# Altium schematic sheet 32.SchDoc
size 513 x 386 mm
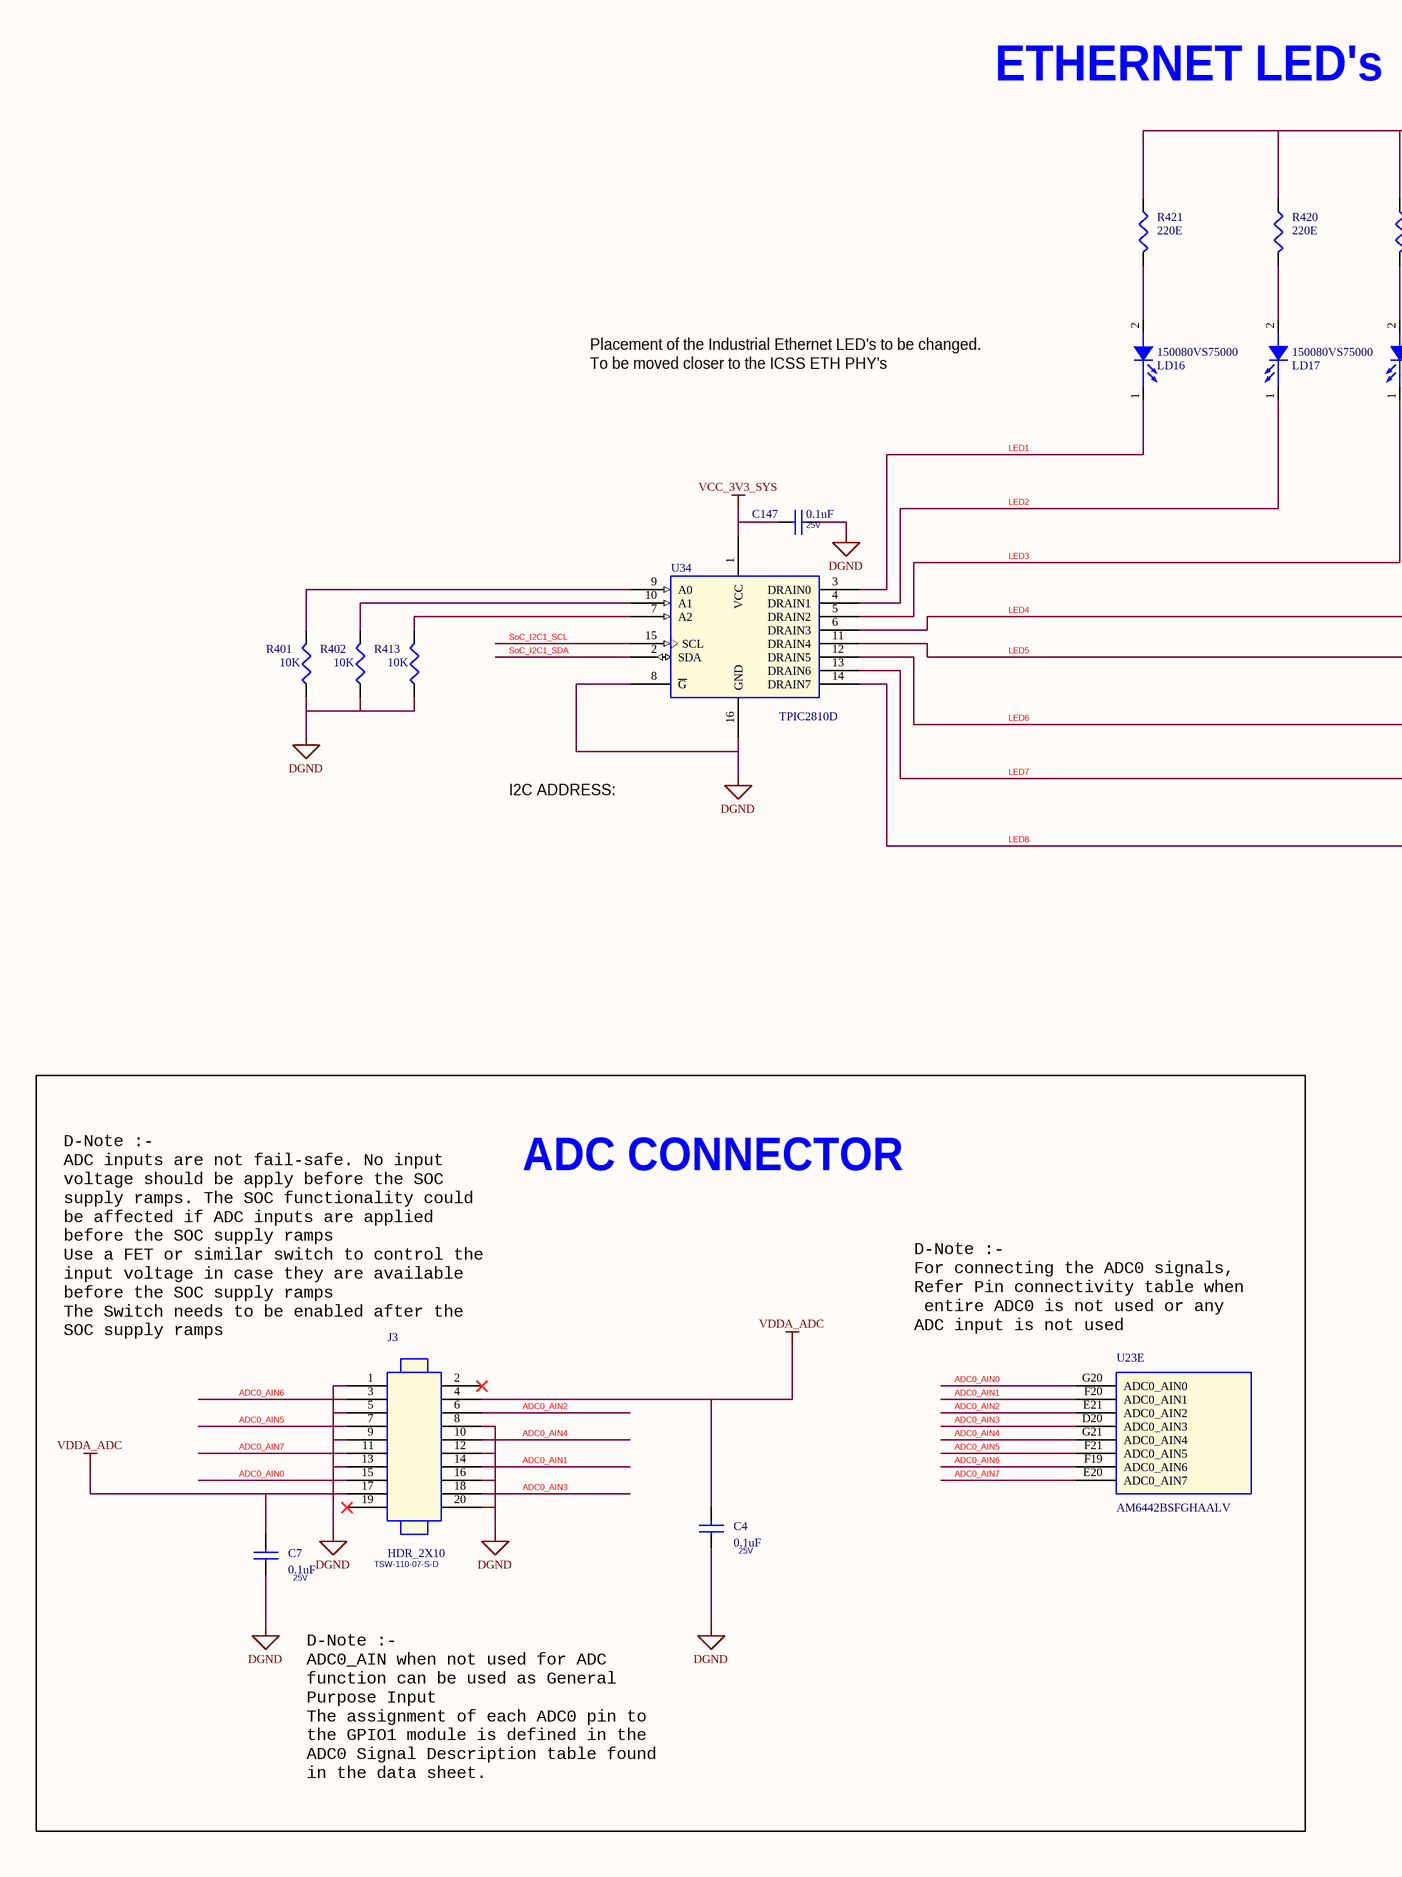
[diagram p0: 32.SchDoc, left]
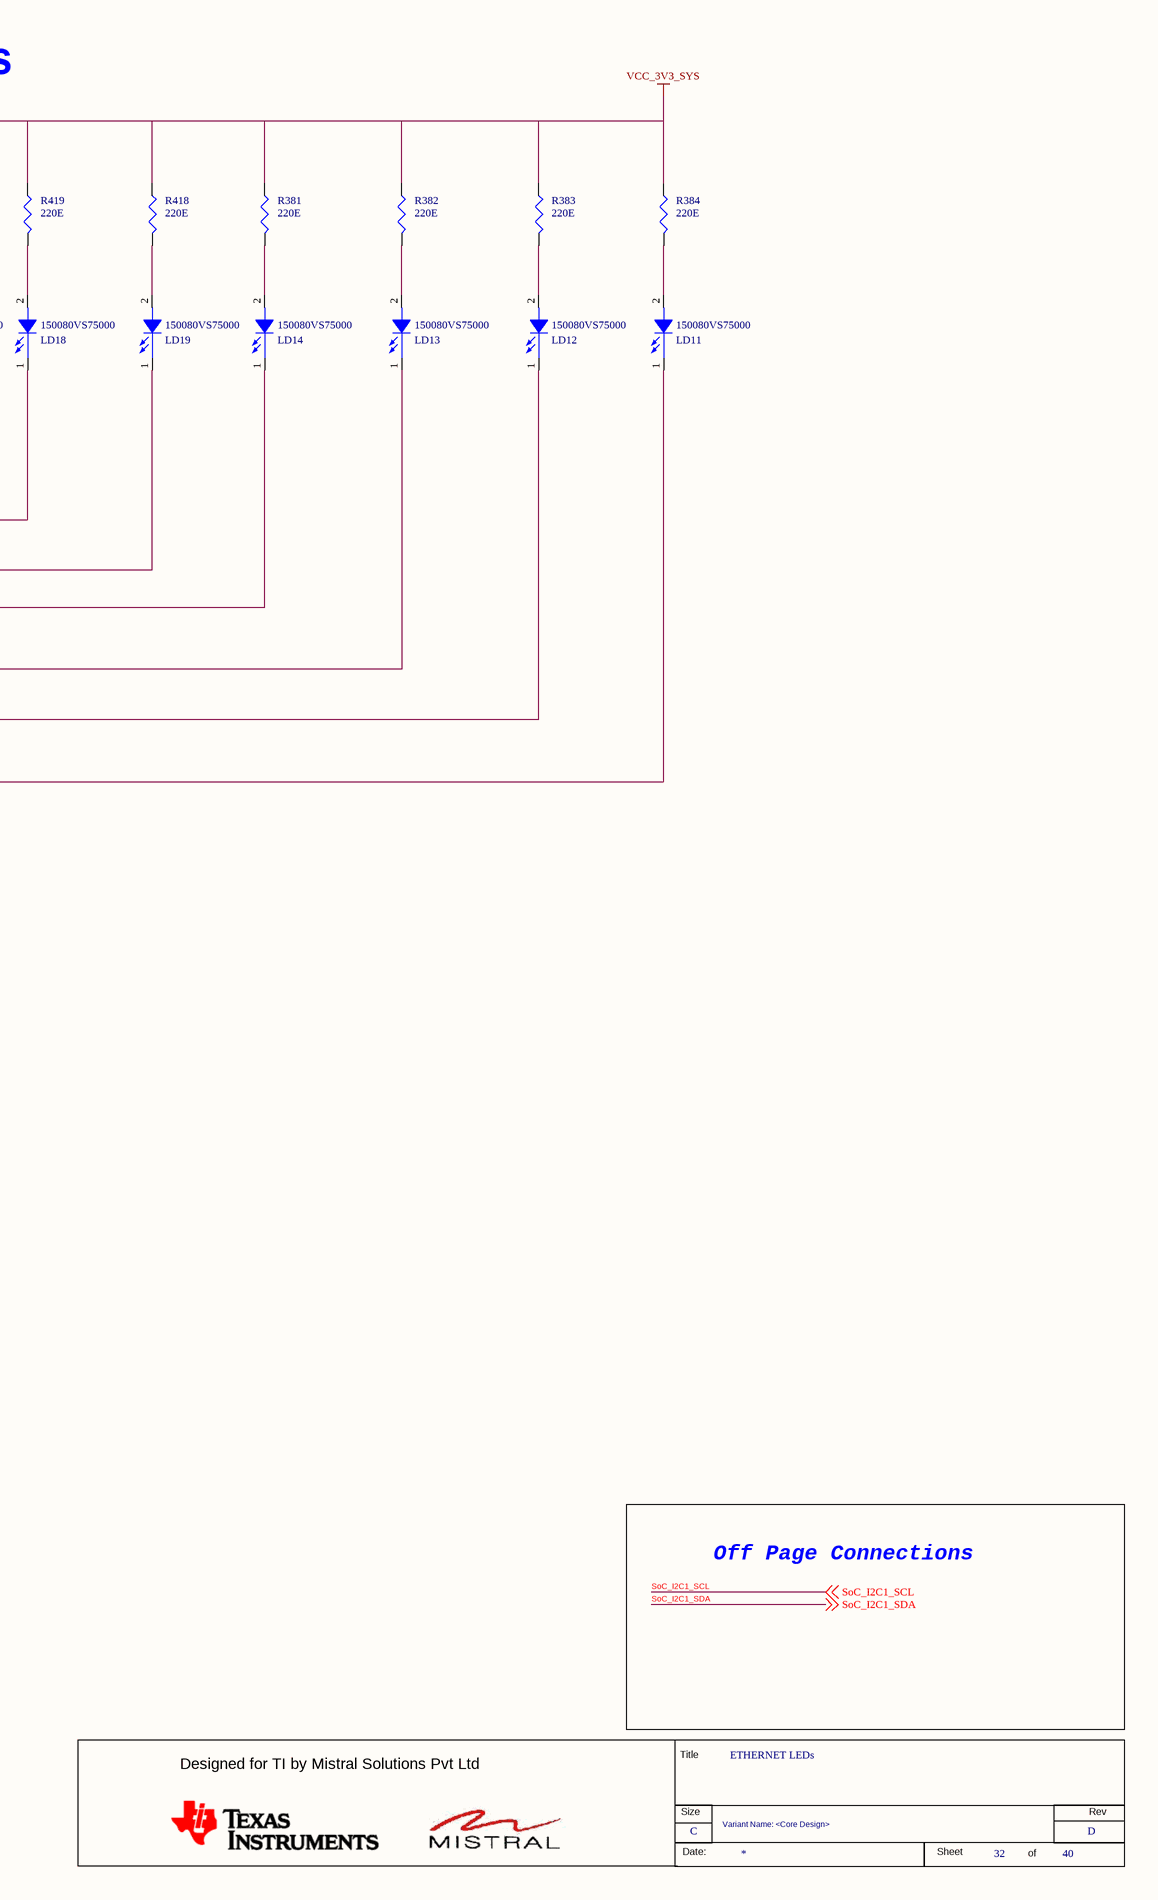
[diagram p1: 32.SchDoc, right]

## Parts
*  RevCode: D  Title: ETHERNET LEDs  Page Size: C  Page Number: 32  Page Count: 40  Variant Name: <Core Design>  (hidden comment: MISTRAL_TITLEBLK_CSIZE)  (graphical)
C4  0.1uF  Voltage: 25V  [CAP0402_0-75]
C7  0.1uF  Voltage: 25V  [CAP0402_0-75]
C147  0.1uF  Voltage: 25V  [CAP0402_0-75]
J3  HDR_2X10  Mfr_part_number: TSW-110-07-S-D  [HDR_2X10_TSW_100_S_T]
LD11  150080VS75000  [LED_150080VS75000_80X50_SMD_0-8]
LD12  150080VS75000  [LED_150080VS75000_80X50_SMD_0-8]
LD13  150080VS75000  [LED_150080VS75000_80X50_SMD_0-8]
LD14  150080VS75000  [LED_150080VS75000_80X50_SMD_0-8]
LD16  150080VS75000  [LED_150080VS75000_80X50_SMD_0-8]
LD17  150080VS75000  [LED_150080VS75000_80X50_SMD_0-8]
LD18  150080VS75000  [LED_150080VS75000_80X50_SMD_0-8]
LD19  150080VS75000  [LED_150080VS75000_80X50_SMD_0-8]
R381  220E  [RES0402_0-5]
R382  220E  [RES0402_0-5]
R383  220E  [RES0402_0-5]
R384  220E  [RES0402_0-5]
R401  10K  [RES0402_0-5]
R402  10K  [RES0402_0-5]
R413  10K  [RES0402_0-5]
R418  220E  [RES0402_0-5]
R419  220E  [RES0402_0-5]
R420  220E  [RES0402_0-5]
R421  220E  [RES0402_0-5]
U23  AM6442BSFGHAALV  [FCBGA441_31-49_680X680_2-6]  (part E of 16)
U34  TPIC2810D  [SOIC16_1-8]

## Blocks framed on the sheet
ADC CONNECTOR: C4 C7 J3 U23

## Nets
DGND: C4.1 C7.1 C147.2 J3.1 J3.5 J3.8 J3.9 J3.12 J3.13 J3.16 J3.20 R401.1 R402.1 R413.1 U34.8(~{G}) U34.16(GND)
VCC_3V3_SYS: C147.1 R381.1 R382.1 R383.1 R384.1 R418.1 R419.1 R420.1 R421.1 U34.1(VCC)
VDDA_ADC: C4.2 C7.2 J3.4 J3.17
ADC0_AIN0: J3.15 U23.G20(ADC0_AIN0)
ADC0_AIN1: J3.14 U23.F20(ADC0_AIN1)
ADC0_AIN2: J3.6 U23.E21(ADC0_AIN2)
ADC0_AIN3: J3.18 U23.D20(ADC0_AIN3)
ADC0_AIN4: J3.10 U23.G21(ADC0_AIN4)
ADC0_AIN5: J3.7 U23.F21(ADC0_AIN5)
ADC0_AIN6: J3.3 U23.F19(ADC0_AIN6)
ADC0_AIN7: J3.11 U23.E20(ADC0_AIN7)
LED1: LD16.1(CATHODE) U34.3(DRAIN0)
LED2: LD17.1(CATHODE) U34.4(DRAIN1)
LED3: LD18.1(CATHODE) U34.5(DRAIN2)
LED4: LD19.1(CATHODE) U34.6(DRAIN3)
LED5: LD14.1(CATHODE) U34.11(DRAIN4)
LED6: LD13.1(CATHODE) U34.12(DRAIN5)
LED7: LD12.1(CATHODE) U34.13(DRAIN6)
LED8: LD11.1(CATHODE) U34.14(DRAIN7)
SoC_I2C1_SCL: U34.15(SCL) ; off-sheet SoC_I2C1_SCL
SoC_I2C1_SDA: U34.2(SDA) ; off-sheet SoC_I2C1_SDA
NetLD11_2: LD11.2(ANODE) R384.2
NetLD12_2: LD12.2(ANODE) R383.2
NetLD13_2: LD13.2(ANODE) R382.2
NetLD14_2: LD14.2(ANODE) R381.2
NetLD16_2: LD16.2(ANODE) R421.2
NetLD17_2: LD17.2(ANODE) R420.2
NetLD18_2: LD18.2(ANODE) R419.2
NetLD19_2: LD19.2(ANODE) R418.2
NetR401_2: R401.2 U34.9(A0)
NetR402_2: R402.2 U34.10(A1)
NetR413_2: R413.2 U34.7(A2)

Not connected (* = marked no-connect by the designer): J3 2* 19*

## Notes on the sheet
- ETHERNET LED's
- Placement of the Industrial Ethernet LED's to be changed.
  To be moved closer to the ICSS ETH PHY's
- I2C ADDRESS: 0x60
- (near J3) D-Note :-
  ADC inputs are not fail-safe. No input
  voltage should be apply before the SOC
  supply ramps. The SOC functionality could
  be affected if ADC inputs are applied
  before the SOC supply ramps
  Use a FET or similar switch to control the
  input voltage in case they are available
  before the SOC supply ramps
  The Switch needs to be enabled after the
  SOC supply ramps
- D-Note :-
  For connecting the ADC0 signals,
  Refer Pin connectivity table when
  entire ADC0 is not used or any
  ADC input is not used
- D-Note :-
  ADC0_AIN when not used for ADC
  function can be used as General
  Purpose Input
  The assignment of each ADC0 pin to
  the GPIO1 module is defined in the
  ADC0 Signal Description table found
  in the data sheet.
- Off Page Connections
- (in symbol MISTRAL_TITLEBLK_CSIZE) Title; Designed for TI by Mistral Solutions Pvt Ltd; Size; Rev; Date:; Sheet; of

## Library data of the parts
* = MISTRAL_TITLEBLK_CSIZE: Issue: 1.0; Page Create Date: March  8, 1995; Page Modify Date: *
C4 C7 = CAP_Dup3: CAP CERAMIC 0.1uF 25V 20% X5R 0402; Alt_Mfr_name: YAGEO AMERICA; Part_type: CAPACITORS\CERAMIC; Mfr_part_number: 885012105018; Mfr_name: WURTH ELECTRONICS; Mistral Part No: 120020080003-R; Alt_Mfr_part_number: CC0402KRX5R8BB104; Custom_Duty: 15%; Customs_HS_Code: 85322990; Wattage: NA; Project: AM64x_EVM_BRD; Footprint Path: Y:\MIS_DATABASE\Library\ALTIUM_TOOL\PCB_FOOTPRINTS\Altium_Footprint_Lib.PcbLib; Library Path: Y:\MIS_DATABASE\Library\ALTIUM_TOOL\SCHEMATICS_PARTS\MS_DISCRETE_Library.schlib; Footprint Ref: CAP0402_0-75; Library Ref: CAP; MECHANICAL 3D STEP FILE: CAP0402_0-75; Chkd/date: MANIRAJA/170820; Crtd /date: ALVY/170820; Datasheet: Y:\MIS_DATABASE\DATASHEETS\CAPACITORS\885012105018.PDF; Temperature: -55癈+85癈; Weight: 0.65mg; Height: 0.55MM; Distributor_part_number: 732-7495-1-ND; Distributor_name: DIGIKEY; Package: 0402; Tolerance: 20%; PCB Footprint: CAP0402_0-75
C147 = CAP_Dup3: CAP CERAMIC 0.1uF 25V 20% X5R 0402; Alt_Mfr_part_number: CC0402KRX5R8BB104; Mistral Part No: 120020080003-R; Mfr_name: WURTH ELECTRONICS; Mfr_part_number: 885012105018; Part_type: CAPACITORS\CERAMIC; Alt_Mfr_name: YAGEO AMERICA; Project: AM64x_EVM_BRD; Wattage: NA; Customs_HS_Code: 85322990; Custom_Duty: 15%; Tolerance: 20%; Package: 0402; Distributor_name: DIGIKEY; Distributor_part_number: 732-7495-1-ND; Height: 0.55MM; Weight: 0.65mg; Temperature: -55癈+85癈; Datasheet: Y:\MIS_DATABASE\DATASHEETS\CAPACITORS\885012105018.PDF; Crtd /date: ALVY/170820; Chkd/date: MANIRAJA/170820; MECHANICAL 3D STEP FILE: CAP0402_0-75; Library Ref: CAP; Footprint Ref: CAP0402_0-75; Library Path: Y:\MIS_DATABASE\Library\ALTIUM_TOOL\SCHEMATICS_PARTS\MS_DISCRETE_Library.schlib; Footprint Path: Y:\MIS_DATABASE\Library\ALTIUM_TOOL\PCB_FOOTPRINTS\Altium_Footprint_Lib.PcbLib; PCB Footprint: CAP0402_0-75
J3 = HEADER_10X2: CON HDR 2X10 2.54MM PITCH ST TH; Part_type: CONNECTOR\HEADERS; Mfr_name: SAMTEC; Mistral Part No: 150009090001-R; Custom_Duty: 0.24; Customs_HS_Code: 85369090; Wattage: NA; Project: SMART VIEW_NVR; PCB Footprint: HDR_2X10_TSW_100_S_T; Library Ref: HEADER_10X2; Chkd/date: NAVEED/140515; Crtd /date: MAZHAR/020909; Datasheet: Y:\MIS_DATABASE\DATASHEETS\CONNECTORS\TSW-106-23-T-S.PDF; Temperature: NA; Weight: NA; Height: 5.02MM; Distributor_part_number: SAM1032-10-ND; Distributor_name: DIGIKEY; Package: THRU-HOLE; Voltage: NA; Tolerance: NA
LD11-LD13 LD16 LD18 LD19 = DIODE_LED: DIODE LED BRIGHT GREEN SMD; Part_type: OPTO\LED; Mfr_name: WURTH ELECTRONICS; Mistral Part No: 130020080012-R; Custom_Duty: 24%; Customs_HS_Code: 85439000; Wattage: NA; Project: AM64x_EVM_BRD; Footprint Path: Y:\MIS_DATABASE\Library\ALTIUM_TOOL\PCB_FOOTPRINTS\Altium_Footprint_Lib.PcbLib; Library Path: Y:\MIS_DATABASE\Library\ALTIUM_TOOL\SCHEMATICS_PARTS\MS_OPTO_Library.schlib; MECHANICAL 3D STEP FILE: LED_150080VS75000_80X50_SMD_0-8; Chkd/date: MANIRAJA/180820; Crtd /date: ALVY/180820; Datasheet: Y:\MIS_DATABASE\DATASHEETS\DISCRETES\LEDS\150080VS75000.PDF; Temperature: -40癈+85癈; Weight: 10mg; Height: 0.80MM; Library Ref: DIODE_LED; Distributor_part_number: 732-4986-1-ND; Distributor_name: DIGIKEY; Package: SMD; Voltage: NA; Tolerance: NA; Mfr_part_number: 150080VS75000; Footprint Ref: LED_150080VS75000_80X50_SMD_0-8; PCB Footprint: LED_150080VS75000_80X50_SMD_0-8
LD14 LD17 = DIODE_LED: DIODE LED BRIGHT GREEN SMD; Mistral Part No: 130020080012-R; Mfr_name: WURTH ELECTRONICS; Part_type: OPTO\LED; Project: AM64x_EVM_BRD; Tolerance: NA; Customs_HS_Code: 85439000; Custom_Duty: 24%; Footprint Ref: LED_150080VS75000_80X50_SMD_0-8; Mfr_part_number: 150080VS75000; Voltage: NA; Wattage: NA; Package: SMD; Distributor_name: DIGIKEY; Distributor_part_number: 732-4986-1-ND; Library Ref: DIODE_LED; Height: 0.80MM; Weight: 10mg; Temperature: -40癈+85癈; Datasheet: Y:\MIS_DATABASE\DATASHEETS\DISCRETES\LEDS\150080VS75000.PDF; Crtd /date: ALVY/180820; Chkd/date: MANIRAJA/180820; MECHANICAL 3D STEP FILE: LED_150080VS75000_80X50_SMD_0-8; Library Path: Y:\MIS_DATABASE\Library\ALTIUM_TOOL\SCHEMATICS_PARTS\MS_OPTO_Library.schlib; Footprint Path: Y:\MIS_DATABASE\Library\ALTIUM_TOOL\PCB_FOOTPRINTS\Altium_Footprint_Lib.PcbLib; PCB Footprint: LED_150080VS75000_80X50_SMD_0-8
R381 R420 R421 = RESISTOR_Dup6: RES 220E 1/10W 5% 0402; Part_type: RESISTORS\FIXED; Mfr_part_number: ERJ-2GEJ221X; Mfr_name: PANASONIC-ECG; Mistral Part No: 110009030506-R; Custom_Duty: 15%; Customs_HS_Code: 85332119; Project: RED EYE; Voltage: NA; Footprint Ref: RES0402_0-5; Chkd/date: VASANTHA/291216; Crtd /date: GEETHA/260406; Datasheet: Y:\MIS_DATABASE\DATASHEETS\RESISTORS\PAN-ERJSER_NOV17.PDF; Height: 0.40MM; Distributor_part_number: P220JCT-ND; Distributor_name: DIGIKEY; Package: 0402; Wattage: 1/10W; Tolerance: 5%; Library Ref: RESISTOR; Weight: 0.8mg; Temperature: -55癈+155癈; MECHANICAL 3D STEP FILE: RES0402_0-5; Library Path: Y:\MIS_DATABASE\Library\ALTIUM_TOOL\SCHEMATICS_PARTS\MS_DISCRETE_Library.schlib; Footprint Path: Y:\MIS_DATABASE\Library\ALTIUM_TOOL\PCB_FOOTPRINTS\Altium_Footprint_Lib.PcbLib; PCB Footprint: RES0402_0-5
R382-R384 = RESISTOR_Dup6: RES 220E 1/10W 5% 0402; Part_type: RESISTORS\FIXED; Mfr_part_number: ERJ-2GEJ221X; Mfr_name: PANASONIC-ECG; Mistral Part No: 110009030506-R; Voltage: NA; Custom_Duty: 15%; Customs_HS_Code: 85332119; Project: RED EYE; Footprint Path: Y:\MIS_DATABASE\Library\ALTIUM_TOOL\PCB_FOOTPRINTS\Altium_Footprint_Lib.PcbLib; Library Path: Y:\MIS_DATABASE\Library\ALTIUM_TOOL\SCHEMATICS_PARTS\MS_DISCRETE_Library.schlib; MECHANICAL 3D STEP FILE: RES0402_0-5; Temperature: -55癈+155癈; Weight: 0.8mg; Library Ref: RESISTOR; Chkd/date: VASANTHA/291216; Crtd /date: GEETHA/260406; Datasheet: Y:\MIS_DATABASE\DATASHEETS\RESISTORS\PAN-ERJSER_NOV17.PDF; Height: 0.40MM; Distributor_part_number: P220JCT-ND; Distributor_name: DIGIKEY; Package: 0402; Wattage: 1/10W; Tolerance: 5%; Footprint Ref: RES0402_0-5; PCB Footprint: RES0402_0-5
R401 = RESISTOR_Dup6: RES 10K 1/16W 5% 0402; Mistral Part No: 110011060021-R; Mfr_name: YAGEO AMERICA; Mfr_part_number: RC0402JR-0710KL; Part_type: RESISTORS\FIXED; Project: HSE; Voltage: NA; Customs_HS_Code: 85332119; Custom_Duty: 15%; Tolerance: 5%; Wattage: 1/16W; Package: 0402; Distributor_name: DIGIKEY; Distributor_part_number: 311-10KJRCT-ND; Height: 0.40MM; Weight: 0.65mg; Temperature: -55癈+155癈; Datasheet: Y:\MIS_DATABASE\DATASHEETS\RESISTORS\RCXXXXL-SER_MAR18.PDF; Crtd /date: MAZHAR/230805; Chkd/date: VASANTHA/061216; MECHANICAL 3D STEP FILE: RES0402_0-5; Library Ref: RESISTOR; Footprint Ref: RES0402_0-5; Library Path: Y:\MIS_DATABASE\Library\ALTIUM_TOOL\SCHEMATICS_PARTS\MS_DISCRETE_Library.schlib; Footprint Path: Y:\MIS_DATABASE\Library\ALTIUM_TOOL\PCB_FOOTPRINTS\Altium_Footprint_Lib.PcbLib; PCB Footprint: RES0402_0-5
R402 R413 = RESISTOR_Dup6: RES 10K 1/16W 5% 0402; Part_type: RESISTORS\FIXED; Mfr_part_number: RC0402JR-0710KL; Mfr_name: YAGEO AMERICA; Mistral Part No: 110011060021-R; Custom_Duty: 15%; Customs_HS_Code: 85332119; Voltage: NA; Project: HSE; MECHANICAL 3D STEP FILE: RES0402_0-5; Chkd/date: VASANTHA/061216; Crtd /date: MAZHAR/230805; Datasheet: Y:\MIS_DATABASE\DATASHEETS\RESISTORS\RCXXXXL-SER_MAR18.PDF; Temperature: -55癈+155癈; Weight: 0.65mg; Height: 0.40MM; Distributor_part_number: 311-10KJRCT-ND; Distributor_name: DIGIKEY; Package: 0402; Wattage: 1/16W; Tolerance: 5%; Library Ref: RESISTOR; Footprint Ref: RES0402_0-5; Library Path: Y:\MIS_DATABASE\Library\ALTIUM_TOOL\SCHEMATICS_PARTS\MS_DISCRETE_Library.schlib; Footprint Path: Y:\MIS_DATABASE\Library\ALTIUM_TOOL\PCB_FOOTPRINTS\Altium_Footprint_Lib.PcbLib; PCB Footprint: RES0402_0-5
R418 R419 = RESISTOR_Dup6: RES 220E 1/10W 5% 0402; Mistral Part No: 110009030506-R; Mfr_name: PANASONIC-ECG; Mfr_part_number: ERJ-2GEJ221X; Part_type: RESISTORS\FIXED; Project: RED EYE; Customs_HS_Code: 85332119; Custom_Duty: 15%; Voltage: NA; Footprint Ref: RES0402_0-5; Tolerance: 5%; Wattage: 1/10W; Package: 0402; Distributor_name: DIGIKEY; Distributor_part_number: P220JCT-ND; Height: 0.40MM; Datasheet: Y:\MIS_DATABASE\DATASHEETS\RESISTORS\PAN-ERJSER_NOV17.PDF; Crtd /date: GEETHA/260406; Chkd/date: VASANTHA/291216; Library Ref: RESISTOR; Weight: 0.8mg; Temperature: -55癈+155癈; MECHANICAL 3D STEP FILE: RES0402_0-5; Library Path: Y:\MIS_DATABASE\Library\ALTIUM_TOOL\SCHEMATICS_PARTS\MS_DISCRETE_Library.schlib; Footprint Path: Y:\MIS_DATABASE\Library\ALTIUM_TOOL\PCB_FOOTPRINTS\Altium_Footprint_Lib.PcbLib; PCB Footprint: RES0402_0-5
U23 = XAM6442BSFGGAALV_BGA441: IC AM64x SoC MICROPROCESSOR BGA441; Mistral Part No: 141220080002; Mfr_name: TEXAS INSTRUMENTS; Part_type: ICS\DIGITAL\MICROPROCESSOR; Project: AM64x-GP_EVM BRD; Tolerance: NA; Customs_HS_Code: 85423100; Custom_Duty: 15%; PCB Footprint: FCBGA441_31-49_680X680_2-6; Footprint Ref: FCBGA441_31-49_680X680_2-6; Mfr_part_number: AM6442BSFGHAALV; Voltage: NA; Wattage: NA; Package: BGA441; Distributor_name: NA; Distributor_part_number: NA; Library Ref: XAM6442BSFGGAALV_BGA441; Height: 2.57MM; Weight: NA; Temperature: NA; Datasheet: Y:\MIS_DATABASE\DATASHEETS\ICS\DIGITAL\MICROCONTROLLER\AM64-SoC_SVB.PDF; Crtd /date: ALVY/300322; Chkd/date: ALVY/300322; RoHS: NA; MECHANICAL 3D STEP FILE: FCBGA441_31-49_680X680_2-6; Library Path: Y:\MIS_DATABASE\Library\ALTIUM_TOOL\SCHEMATICS_PARTS\MS_MICROPROCESSOR_Library.schlib; Footprint Path: Y:\MIS_DATABASE\Library\ALTIUM_TOOL\PCB_FOOTPRINTS\Altium_Footprint_Lib.PcbLib
U34 = TPIC2810D_SOIC16: IC 8-BIT LED DRIVER WITH I2C INTERFACE SOIC16; Mistral Part No: 141017080026-R; Mfr_name: TEXAS INSTRUMENTS; Part_type: ICS\INTERFACE; Project: TI_MAXIE_CPB; Tolerance: NA; Customs_HS_Code: 85423100; Custom_Duty: 15%; Mfr_part_number: TPIC2810D; Voltage: NA; Wattage: NA; Package: SOIC16; Distributor_name: DIGIKEY; Distributor_part_number: 296-13746-5-ND; Height: 1.75MM; Weight: NA; Temperature: -40癈+125癈; Datasheet: Y:\MIS_DATABASE\DATASHEETS\ICS\INTERFACE\TPIC2810D.PDF; Crtd /date: MANIRAJA/220817; Chkd/date: MANIRAJA/230817; MECHANICAL 3D STEP FILE: SOIC16_1-8; Library Ref: TPIC2810D_SOIC16; PCB Footprint: SOIC16_1-8